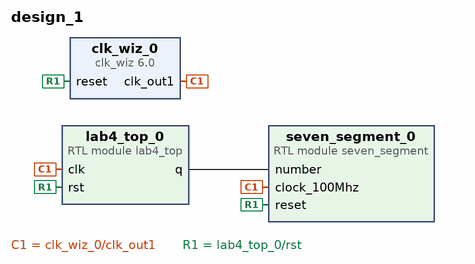
[diagram p0: block diagram of the top level]
# Vivado block design design_1, xc7a35tcpg236-1, Vivado 2022.2
create_bd_design design_1

create_bd_cell -type module -reference lab4_top lab4_top_0
create_bd_cell -type ip -vlnv xilinx.com:ip:clk_wiz:6.0 clk_wiz_0
create_bd_cell -type module -reference seven_segment seven_segment_0

# ---- connections ----

connect_bd_net [get_bd_pins clk_wiz_0/clk_out1] [get_bd_pins lab4_top_0/clk] [get_bd_pins seven_segment_0/clock_100Mhz]
connect_bd_net [get_bd_pins lab4_top_0/rst] [get_bd_pins clk_wiz_0/reset] [get_bd_pins seven_segment_0/reset]
connect_bd_net [get_bd_pins lab4_top_0/q] [get_bd_pins seven_segment_0/number]

validate_bd_design
save_bd_design
